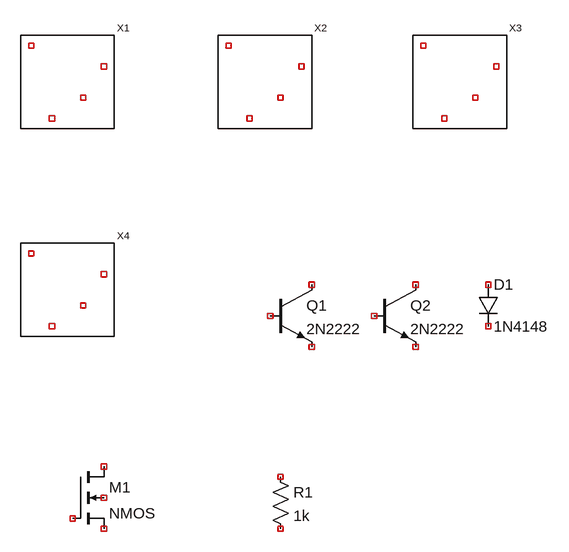
[diagram p0: schematic attributes.asc]
attributes.asc, the LTspice schematic file:
Version 4
SHEET 1 880 680
SYMBOL cell4 96 160 R0
SYMATTR InstName X1
SYMATTR Value sub1
SYMATTR SpiceLine gain=2
SYMBOL cell4 400 160 R0
SYMATTR InstName X2
SYMATTR Value sub2
SYMATTR Value2 extra=1
SYMATTR SpiceLine a=1
SYMATTR SpiceLine2 b=2
SYMBOL cell4 700 160 R0
SYMATTR InstName X3
SYMATTR Value sub3
SYMATTR SpiceModel mdl
SYMBOL cell4 96 480 R0
SYMATTR InstName X4
SYMATTR Value sub4
SYMATTR SpiceLine params: r=2k
SYMBOL npn 400 480 R0
SYMATTR InstName Q1
SYMATTR Value 2N2222
SYMATTR Value2 2
SYMBOL npn 560 480 R0
SYMATTR InstName Q2
SYMATTR Value 2N2222
SYMATTR SpiceLine area=2
SYMBOL diode 720 480 R0
SYMATTR InstName D1
SYMATTR Value 1N4148
SYMATTR Value2 3
SYMBOL nmos4 96 760 R0
SYMATTR InstName M1
SYMATTR Value NMOS
SYMATTR Value2 l=1u w=10u
SYMBOL res 400 760 R0
SYMATTR InstName R1
SYMATTR Value 1k
SYMATTR SpiceLine tol=1 pwr=0.1

The netlist it stands for:
* attributes.asc
XX1 NC_01 NC_02 NC_03 NC_04 sub1 gain=2  ; pins a b c d
XX2 NC_05 NC_06 NC_07 NC_08 sub2 extra=1 a=1 b=2  ; pins a b c d
XX3 NC_09 NC_10 NC_11 NC_12 mdl sub3  ; pins a b c d
XX4 NC_13 NC_14 NC_15 NC_16 sub4 params: r=2k  ; pins a b c d
Q1 NC_17 NC_18 NC_19 0 2N2222 2
Q2 NC_20 NC_21 NC_22 0 2N2222 area=2
D1 NC_23 NC_24 1N4148 3
M1 NC_25 NC_26 NC_27 NC_28 NMOS l=1u w=10u
R1 NC_29 NC_30 1k tol=1 pwr=0.1
.model D D
.lib standard.dio
.model NPN NPN
.model PNP PNP
.lib standard.bjt
.model NMOS NMOS
.model PMOS PMOS
.lib standard.mos
.backanno
.end